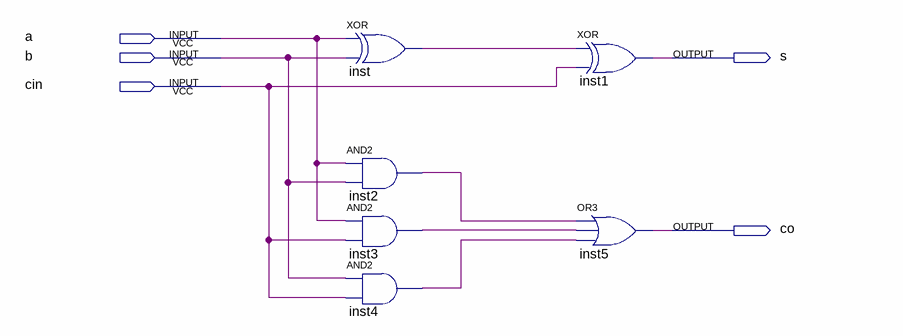
[diagram p0: schematic sheet]
// Quartus schematic allplus.bdf as structural Verilog: 6 symbols, 5 pins
module allplus (
  input  a,
  input  b,
  input  cin,
  output s,
  output co
);

  wire inst2_out, inst3_out, inst4_out, inst_out;

  xor inst (inst_out, a, b);
  and inst2 (inst2_out, a, b);
  and inst3 (inst3_out, a, cin);
  and inst4 (inst4_out, b, cin);
  xor inst1 (s, inst_out, cin);
  or inst5 (co, inst2_out, inst3_out, inst4_out);
endmodule
